# EAGLE design CANdiy-Shield_v12 (EAGLE 6.6.0)
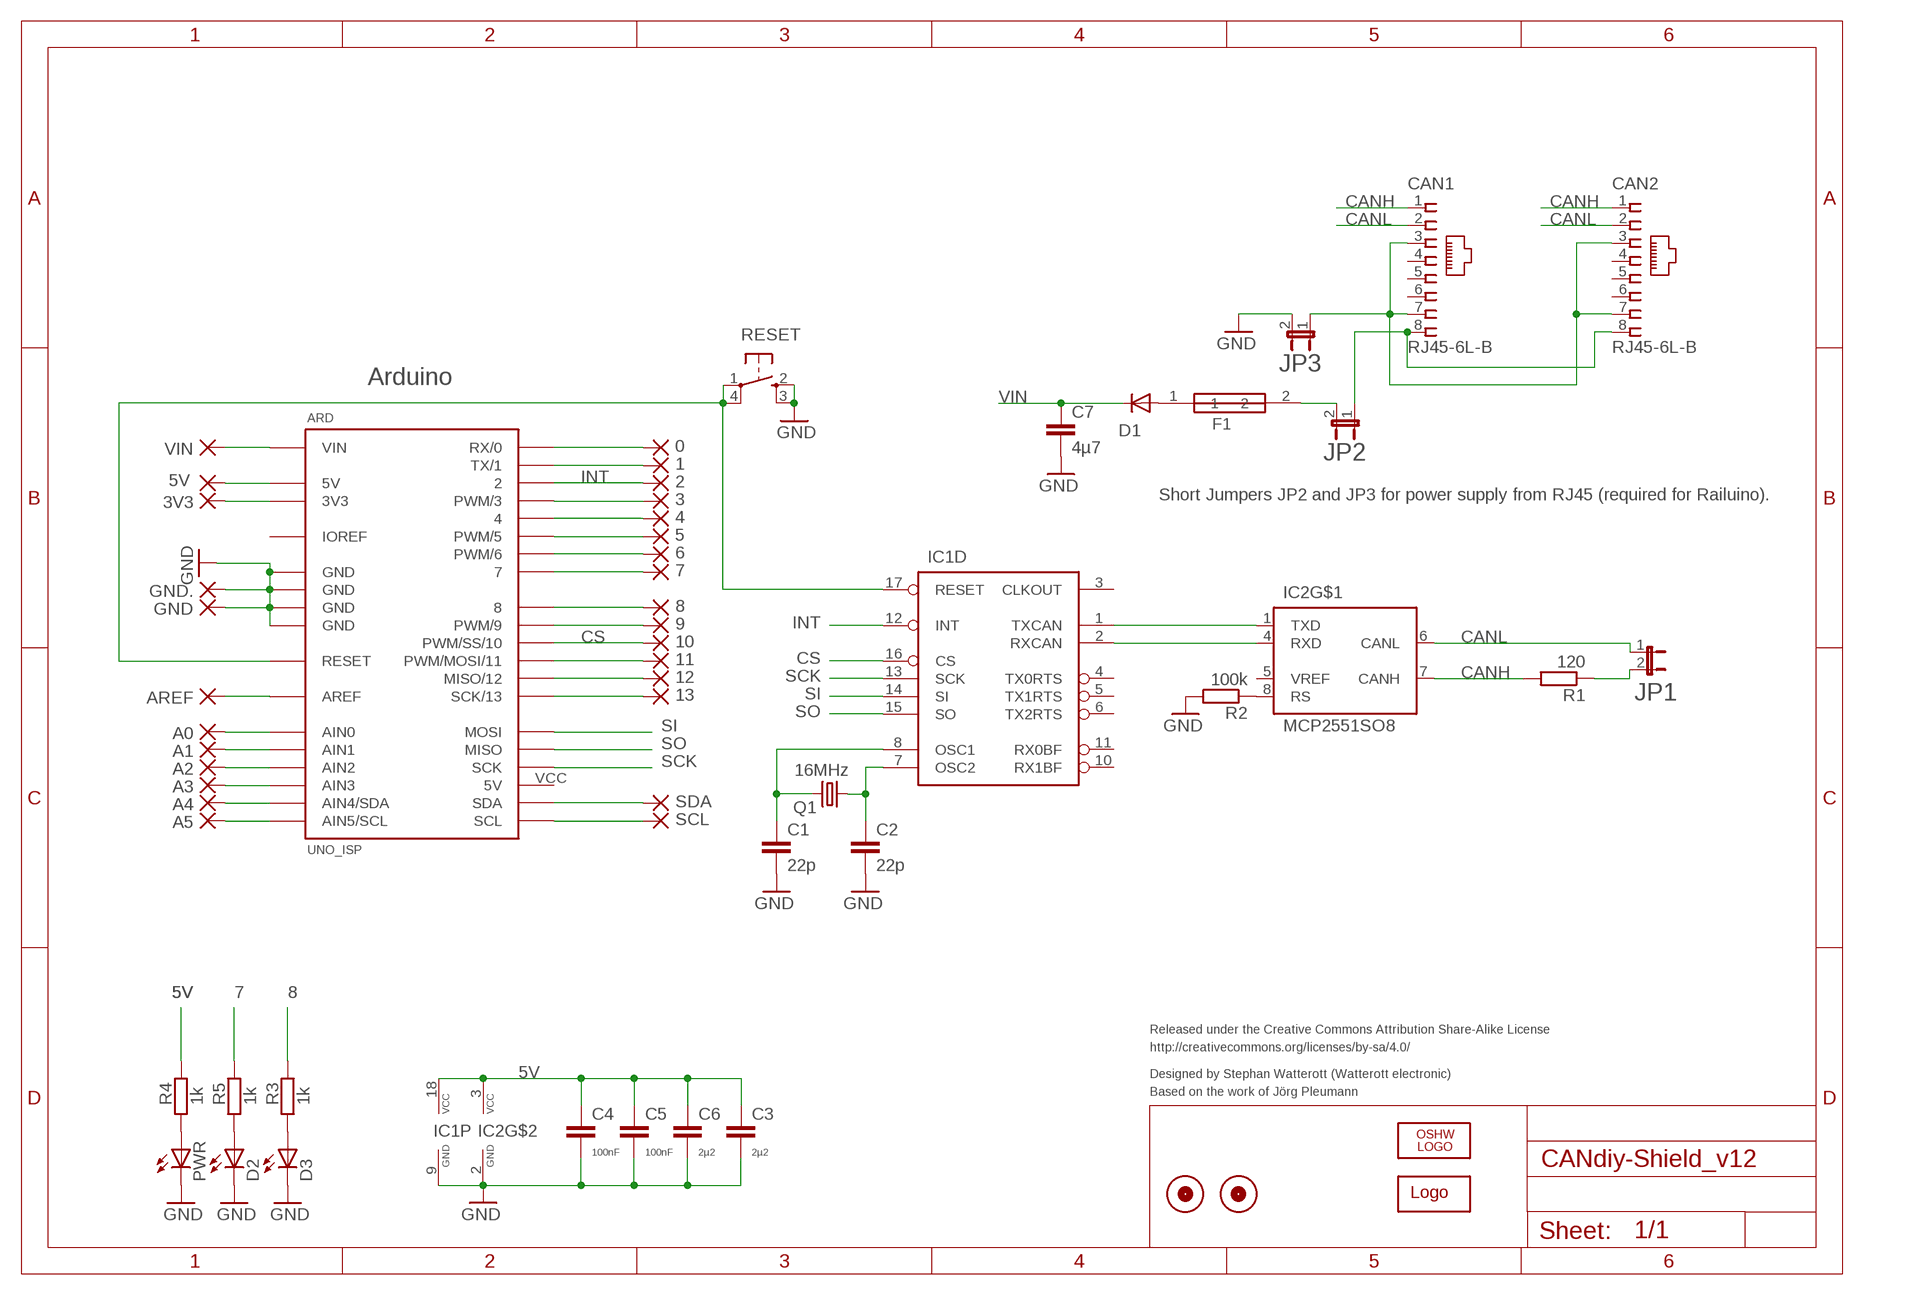
[diagram p0: schematic, sheet 1]

## Parts
0  1,6/0,8  [1,6/0,8]
1  1,6/0,8  [1,6/0,8]
2  1,6/0,8  [1,6/0,8]
3  1,6/0,8  [1,6/0,8]
3V3  1,6/0,8  [1,6/0,8]
4  1,6/0,8  [1,6/0,8]
5  1,6/0,8  [1,6/0,8]
5V  1,6/0,8  [1,6/0,8]
6  1,6/0,8  [1,6/0,8]
7  1,6/0,8  [1,6/0,8]
8  1,6/0,8  [1,6/0,8]
9  1,6/0,8  [1,6/0,8]
10  1,6/0,8  [1,6/0,8]
11  1,6/0,8  [1,6/0,8]
12  1,6/0,8  [1,6/0,8]
13  1,6/0,8  [1,6/0,8]
A0  1,6/0,8  [1,6/0,8]
A1  1,6/0,8  [1,6/0,8]
A2  1,6/0,8  [1,6/0,8]
A3  1,6/0,8  [1,6/0,8]
A4  1,6/0,8  [1,6/0,8]
A5  1,6/0,8  [1,6/0,8]
ARD  UNO_ISP  [UNO_ISP]
AREF  1,6/0,8  [1,6/0,8]
C1  22p  C-EUC0603  [C0603]
C2  22p  C-EUC0603  [C0603]
C3  2µ2  C-EUC0603  [C0603]
C4  100nF  C-EUC0603  [C0603]
C5  100nF  C-EUC0603  [C0603]
C6  2µ2  C-EUC0603  [C0603]
C7  4µ7  C-EUC1206  [C1206]
CAN1  RJ45-6L-B  [RJ45-NO-SHIELD]
CAN2  RJ45-6L-B  [RJ45-NO-SHIELD]
D1  CGRM4001-G  [SOD-123_MINI-SMA]
D2  LEDCHIPLED_0603  [CHIPLED_0603]
D3  LEDCHIPLED_0603  [CHIPLED_0603]
F1  F1  FUSE1812  [L1812]
GND  1,6/0,8  [1,6/0,8]
GND.  1,6/0,8  [1,6/0,8]
IC1  MCP2515SO  [SO-18W]
IC2  MCP2551SO8  [SO08]
JP1  JP1E  [JP1]
JP2  JP1E  [JP1]
JP3  JP1E  [JP1]
LOGO2  OSHW_LOGO_6MILX0100-NT  [OSHW_6X100_NOTEXT]
PWR  LEDCHIPLED_0603  [CHIPLED_0603]
Q1  16MHz  CRYSTALHC49UP  [HC49UP]
R1  120  R-EU_R0603  [R0603]
R2  100k  R-EU_R0603  [R0603]
R3  1k  R-EU_R0603  [R0603]
R4  1k  R-EU_R0603  [R0603]
R5  1k  R-EU_R0603  [R0603]
RESET  SW_SMDS  [SW_SMD4]
SCL  1,6/0,8  [1,6/0,8]
SDA  1,6/0,8  [1,6/0,8]
U$1  WE-LOGO  [WE-LOGO]
VIN  1,6/0,8  [1,6/0,8]
X_1  PASS_1MM  [ROUND_1MM]
X_2  PASS_1MM  [ROUND_1MM]

## Nets
3V3: 3V3.1(P) ARD.3V3
5V: 5V.1(P) ARD.5V C3.1 C4.1 C5.1 C6.1 IC1.18(P:VCC) IC2.3(VCC) R4.1
7: 7.1(P) ARD.7 R5.1
8: 8.1(P) ARD.8 R3.1
9: 9.1(P) ARD.9(PWM/9)
A0: A0.1(P) ARD.AIN0
AERF: ARD.AREF AREF.1(P)
CANH: CAN1.1 CAN2.1 IC2.7(CANH) R1.2
CANL: CAN1.2 CAN2.2 IC2.6(CANL) JP1.1
CS: 10.1(P) ARD.10(PWM/SS/10) IC1.16(D:CS)
GND: ARD.GND@1(GND) ARD.GND@2(GND) ARD.GND@3(GND) ARD.GND@4(GND) C1.2 C2.2 C3.2 C4.2 C5.2 C6.2 C7.2 D2.C D3.C GND.1(P) GND..1(P) IC1.9(P:GND) IC2.2(GND) JP3.2 PWR.C R2.2 RESET.2(S) RESET.3(S1)
INT: 2.1(P) ARD.2 IC1.12(D:INT)
N$4: C2.1 IC1.7(D:OSC2) Q1.1
N$5: C1.1 IC1.8(D:OSC1) Q1.2
N$6: CAN1.8 CAN2.8 JP2.1
N$7: IC2.8(RS) R2.1
N$8: CAN1.3 CAN1.7 CAN2.3 CAN2.7 JP3.1
N$9: JP1.2 R1.1
N$18: ARD.SCL SCL.1(P)
N$19: ARD.SDA SDA.1(P)
N$21: D3.A R3.2
N$22: PWR.A R4.2
N$23: D2.A R5.2
N$86: 11.1(P) ARD.11(PWM/MOSI/11)
N$87: 12.1(P) ARD.12(MISO/12)
N$88: 13.1(P) ARD.13(SCK/13)
N$98: 6.1(P) ARD.6(PWM/6)
N$99: 5.1(P) ARD.5(PWM/5)
N$100: 4.1(P) ARD.4
N$101: 3.1(P) ARD.3(PWM/3)
N$102: 1.1(P) ARD.1(TX/1)
N$103: 0.1(P) ARD.0(RX/0)
N$114: A1.1(P) ARD.AIN1
N$115: A2.1(P) ARD.AIN2
N$116: A3.1(P) ARD.AIN3
N$117: A4.1(P) ARD.AIN4(AIN4/SDA)
N$118: A5.1(P) ARD.AIN5(AIN5/SCL)
N$120: D1.A F1.1
N$121: F1.2 JP2.2
RESET: ARD.RST(RESET) IC1.17(D:RESET) RESET.1(P) RESET.4(P1)
RXCAN: IC1.2(D:RXCAN) IC2.4(RXD)
SCK: ARD.SCK IC1.13(D:SCK)
SI: ARD.MOSI IC1.14(D:SI)
SO: ARD.MISO IC1.15(D:SO)
TXCAN: IC1.1(D:TXCAN) IC2.1(TXD)
VIN: ARD.VIN C7.1 D1.C VIN.1(P)
Unconnected: ARD.VCC(5V) CAN1.4 CAN1.5 CAN1.6 CAN2.4 CAN2.5 CAN2.6 IC1.3(D:CLKOUT) IC1.4(D:TX0RTS) IC1.5(D:TX1RTS) IC1.6(D:TX2RTS) IC1.10(D:RX1BF) IC1.11(D:RX0BF) IC2.5(VREF)

## Notes on the sheet
- Arduino
- F1
- Short Jumpers JP2 and JP3 for power supply from RJ45 (required for Railuino).
- Released under the Creative Commons Attribution Share-Alike License
- http://creativecommons.org/licenses/by-sa/4.0/
- Designed by Stephan Watterott (Watterott electronic)
- Based on the work of Jörg Pleumann

## Power pins joined to a net without a drawn wire
IOREF: ARD.IOREF

## Library data of the parts
0 1-3 3V3 4 5 5V 6-13 A0 A1-A5 AREF GND GND. SCL SDA VIN = wirepad:1,6/0,8: THROUGH-HOLE PAD
ARD = Arduino:UNO_ISP
C1-C7 = resistor:C-EU: CAPACITOR, European symbol
CAN1 CAN2 = con-tycoelectronics:RJ45: CORCOM Modular RJ Jacks No Shield Source: www.tycoelectronics.com .. ENG_DS_1654001_1099_RJ_L_0507.pdf; MPN: RJ45-6L-B; OC_FARNELL: unknown; OC_NEWARK: 16R6090
D1 = diode:CGRM400*-G: Molded plasitc,JEDEC SOD-123/Mini SMA Source: Comchip CGRM4001-G.pdf
D2 D3 PWR = led:LED: LED OSRAM: - CHIPLED LG R971, LG N971, LY N971, LG Q971, LY Q971, LO R971, LY R971 LH N974, LH R974 LS Q976, LO Q976, LY Q976 LO Q996 - Hyper CHIPLED LW Q18S LB Q993, LB Q99A, LB R99A - SideLED LS A670, LO A670, LY A670, LG A670, LP A670 LB A673, LV A673, LT A673, LW A673 LH A674 LY A675 LS A676, LA A676, LO A676, LY A676, LW A676 LS A679, LY A679, LG A679 - Hyper Micro SIDELED® LS Y876, LA Y876, LO Y876, LY Y876 LT Y87S - SmartLED LW L88C, LW L88S LB L89C, LB L89S, LG L890 LS L89K, LO L89K, LY L89K LS L896, LA L896, LO L896, LY L896 - TOPLED LS T670, LO T670, LY T670, LG T670, LP T670 LSG T670, LSP T670, LSY T670, LOP T670, LYG T670 LG T671, LOG T671, LSG T671 LB T673, LV T673, LT T673, LW T673 LH T674 LS T676, LA T676, LO T676, LY T676, LB T676, LH T676, LSB T676, LW T676 LB T67C, LV T67C, LT T67C, LS T67K, LO T67K, LY T67K, LW E67C LS E67B, LA E67B, LO E67B, LY E67B, LB E67C, LV E67C, LT E67C LW T67C LS T679, LY T679, LG T679 LS T770, LO T770, LY T770, LG T770, LP T770 LB T773, LV T773, LT T773, LW T773 LH T774 LS E675, LA E675, LY E675, LS T675 LS T776, LA T776, LO T776, LY T776, LB T776 LHGB T686 LT T68C, LB T68C - Hyper Mini TOPLED® LB M676 - Mini TOPLED Santana® LG M470 LS M47K, LO M47K, LY M47K Source: http://www.osram.convergy.de LUXEON: - LUMILED® LXK2-PW12-R00, LXK2-PW12-S00, LXK2-PW14-U00, LXK2-PW14-V00 LXK2-PM12-R00, LXK2-PM12-S00, LXK2-PM14-U00 LXK2-PE12-Q00, LXK2-PE12-R00, LXK2-PE12-S00, LXK2-PE14-T00, LXK2-PE14-U00 LXK2-PB12-K00, LXK2-PB12-L00, LXK2-PB12-M00, LXK2-PB14-N00, LXK2-PB14-P00, LXK2-PB14-Q00 LXK2-PR12-L00, LXK2-PR12-M00, LXK2-PR14-Q00, LXK2-PR14-R00 LXK2-PD12-Q00, LXK2-PD12-R00, LXK2-PD12-S00 LXK2-PH12-R00, LXK2-PH12-S00 LXK2-PL12-P00, LXK2-PL12-Q00, LXK2-PL12-R00 Source: www.luxeon.com KINGBRIGHT: KA-3528ASYC Source: www.kingbright.com
F1 = resistor:FUSE1812
IC1 = can:MCP2515: MC2515 Stand-Alone CAN Controller With SPI Interface, Microchip
IC2 = can:MCP2551: CAN Tranceiver Microchip
JP1-JP3 = jumper:JP1E: JUMPER
LOGO2 = OSHW:OSHW_LOGO_6MIL
Q1 = crystal:CRYSTAL: CRYSTAL; OC_FARNELL: unknown; OC_NEWARK: unknown
R1 R2 = resistor:R-EU_: RESISTOR, European symbol
R3-R5 = rcl:R-EU_: RESISTOR, European symbol
RESET = Switch-SMD:SW_SMD
U$1 = welectronic:WE-LOGO
X_1 X_2 = marks:PASS_1MM

## Board
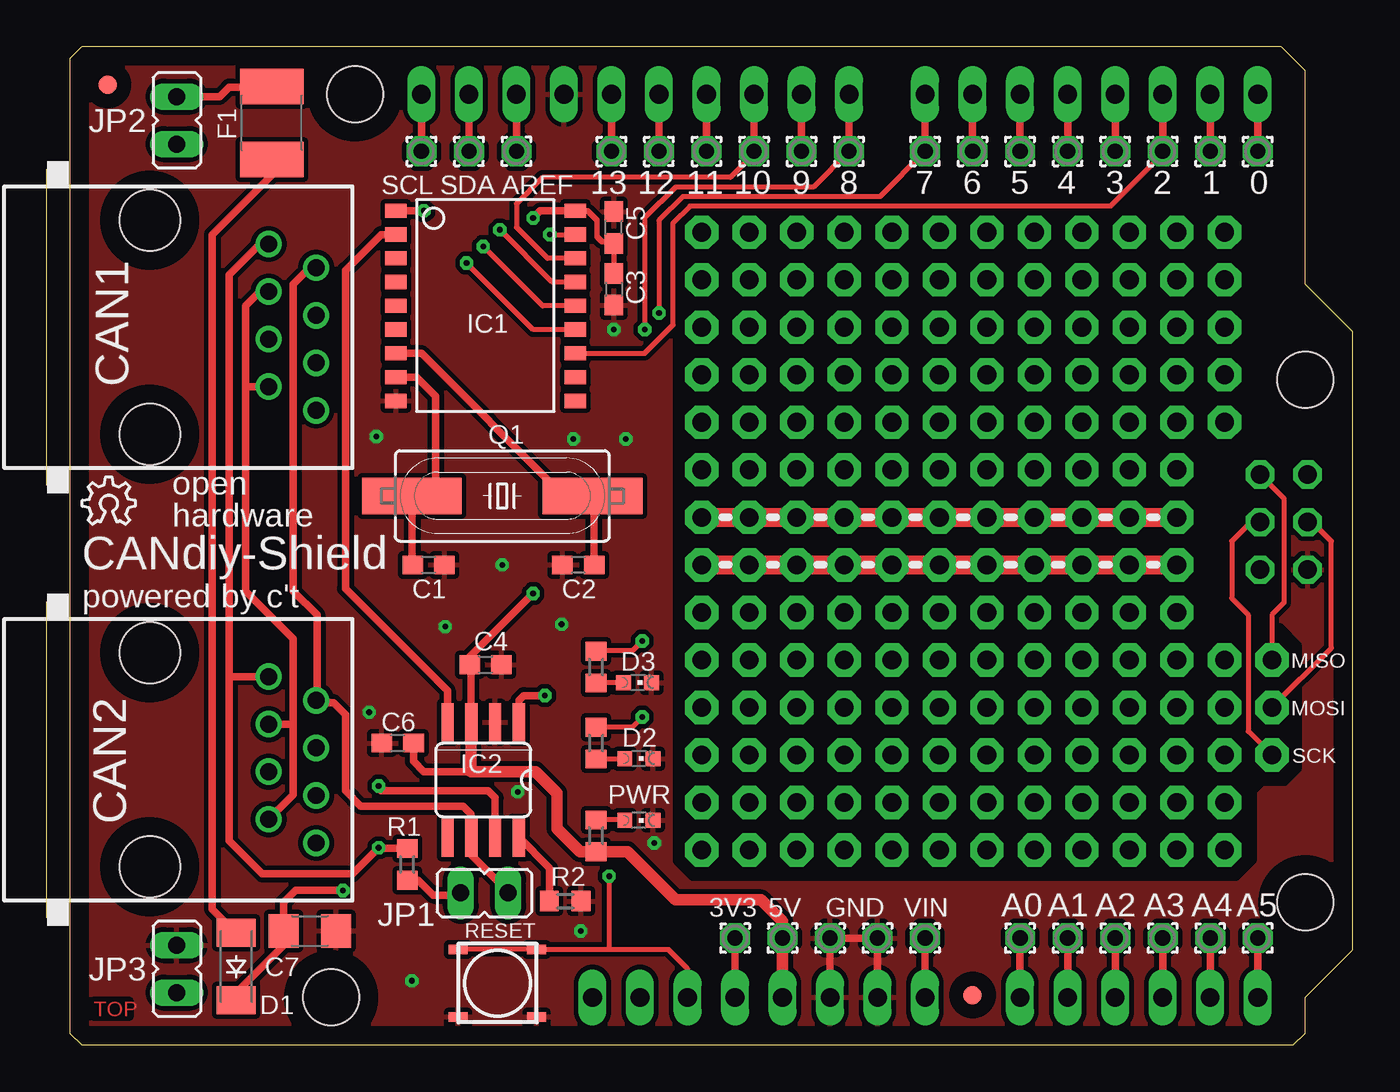
[diagram p1: board, top side]
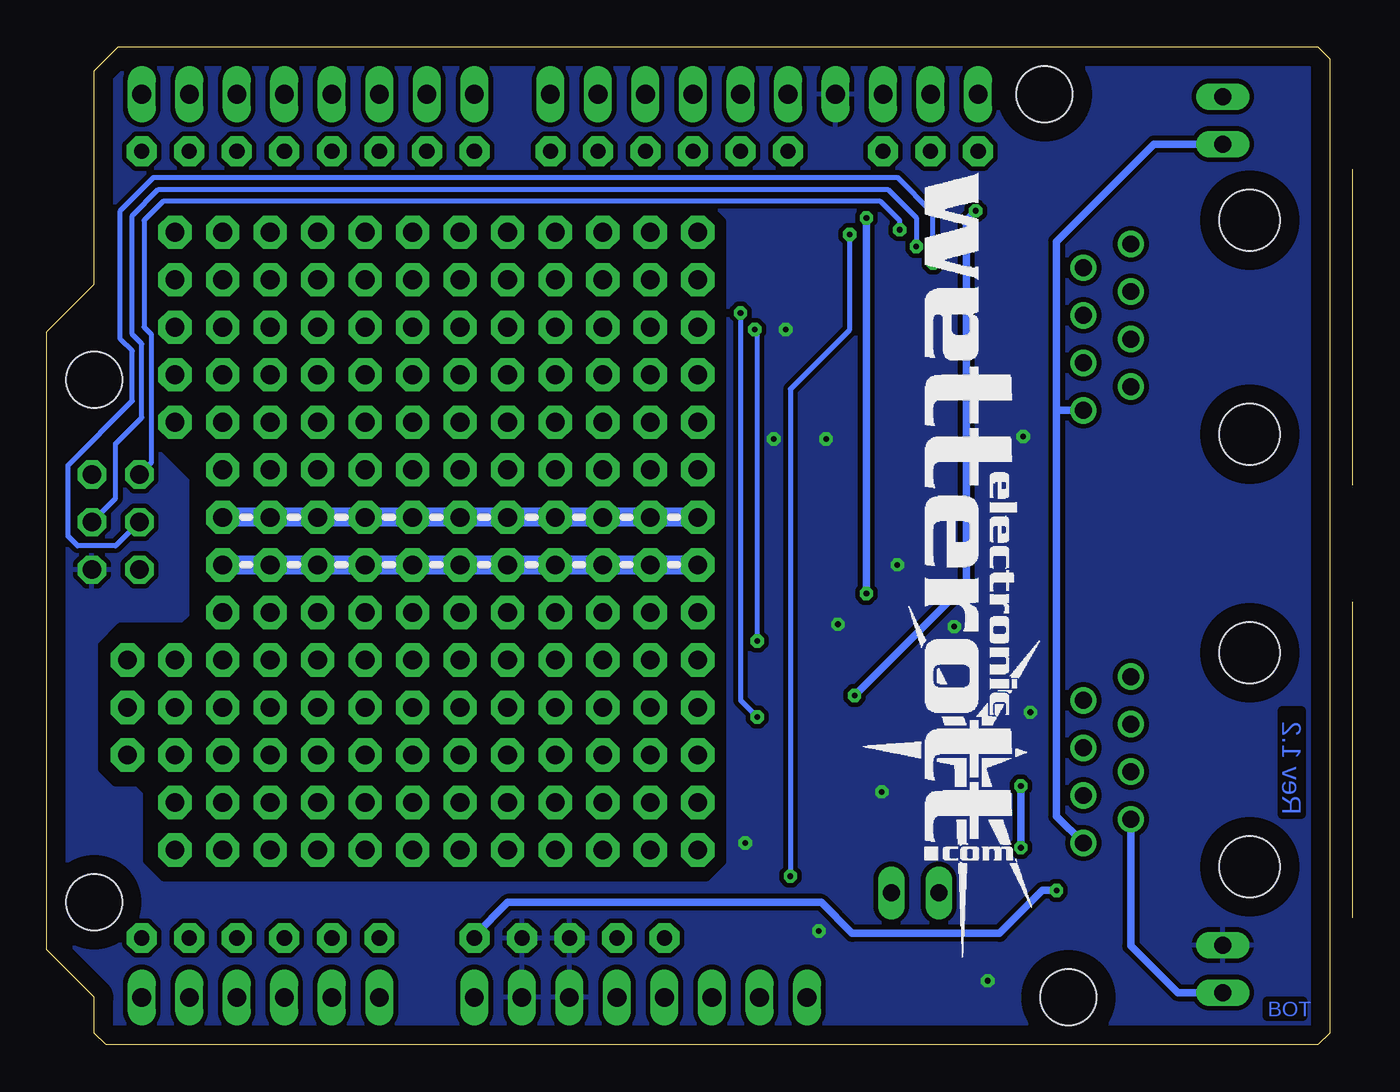
[diagram p2: board, bottom side, seen from below]

Size 69.81 x 53.34 mm. Coordinates in mm from the lower left corner, seen from the top.
Copper layers (1*16): Top 0.035mm / dielectric 1.5mm / Bottom 0.035mm
Design rules "default *": minimum track width 8mil, minimum drill 0.3mm, track to track 8mil, track to pad 8mil, pad to pad 8mil, via to via 8mil, smd to smd 8mil, copper to edge 40mil, drill to drill 8mil, minimum pad ring 10mil, minimum via ring 8mil, stop-mask expansion 4mil, vias tented up to drill 0.6mm, thermal gap 10mil

### Footprints (pad centres in the part's own frame; a part is rotated, then mirrored left to right if it is on the bottom)
1,6/0,8 = drill 0.813 pad 1.6 octagon: 1 0,0
UNO_ISP = drill 1 long: 0 63.5,50.8; 1 60.96,50.8; 2 58.42,50.8; 3 55.88,50.8; 3V3 35.56,2.54; 4 53.34,50.8; 5 50.8,50.8; 5V 38.1,2.54; 6 48.26,50.8; 7 45.72,50.8; 8 41.656,50.8; 9 39.116,50.8; 10 36.576,50.8; 11 34.036,50.8; 12 31.496,50.8; 13 28.956,50.8; AIN0 50.8,2.54; AIN1 53.34,2.54; AIN2 55.88,2.54; AIN3 58.42,2.54; AIN4 60.96,2.54; AIN5 63.5,2.54; AREF 23.876,50.8; GND@1 40.64,2.54; GND@2 43.18,2.54; GND@3 26.416,50.8; IOREF 30.48,2.54; NC 27.94,2.54; RST 33.02,2.54; SCL 18.796,50.8; SDA 21.336,50.8; VIN 45.72,2.54 | drill 1 octagon: GND@4 66.167,25.4; MISO 63.627,30.48; MOSI 66.167,27.94; RST2 63.627,25.4; SCK 63.627,27.94; VCC 66.167,30.48 | hole 3: 66.04,35.56; 66.04,7.62; 15.24,50.8; 13.97,2.54
C0603 = smd 1.1 x 1: 1 -0.85,0; 2 0.85,0
C1206 = smd 1.6 x 1.8: 1 -1.4,0; 2 1.4,0
RJ45-NO-SHIELD = drill 0.9 pad 1.4: 1 -4.445,6.35; 2 -3.175,8.89; 3 -1.905,6.35; 4 -0.635,8.89; 5 0.635,6.35; 6 1.905,8.89; 7 3.175,6.35; 8 4.445,8.89 | hole 3.251: -5.715,0; 5.715,0
SOD-123_MINI-SMA = smd 1.5 x 2.1: A 1.8,0; C -1.8,0
CHIPLED_0603 = smd 0.8 x 0.8: A 0,-0.75; C 0,0.75
L1812 = smd 1.9 x 3.4: 1 -1.95,0; 2 1.95,0
SO-18W = smd 0.762 x 1.143: 1 -5.08,-4.788; 2 -3.81,-4.788; 3 -2.54,-4.788; 4 -1.27,-4.788; 5 0,-4.788; 6 1.27,-4.788; 7 2.54,-4.788; 8 3.81,-4.788; 9 5.08,-4.788; 10 5.08,4.788; 11 3.81,4.788; 12 2.54,4.788; 13 1.27,4.788; 14 0,4.788; 15 -1.27,4.788; 16 -2.54,4.788; 17 -3.81,4.788; 18 -5.08,4.788
SO08 = smd 0.66 x 2.032: 1 -1.905,-3.073; 2 -0.635,-3.073; 3 0.635,-3.073; 4 1.905,-3.073; 5 1.905,3.073; 6 0.635,3.073; 7 -0.635,3.073; 8 -1.905,3.073
JP1 = drill 0.914 long: 1 0,-1.27; 2 0,1.27
HC49UP = smd 5.334 x 1.93: 1 -4.826,0; 2 4.826,0
R0603 = smd 1 x 1.1: 1 -0.85,0; 2 0.85,0
SW_SMD4 = smd 0.508 x 1.016: 1 -1.8,-2.1; 2 1.8,-2.1; 3 1.8,2.1; 4 -1.8,2.1
ROUND_1MM = smd 1 x 1: P$1 0,0

### Placement (x,y rotation side)
0  64.73,47.75 180 top
1  62.19,47.75 180 top
2  59.65,47.75 180 top
3  57.11,47.75 180 top
3V3  36.79,5.71 0 top
4  54.57,47.75 180 top
5  52.03,47.75 180 top
5V  39.33,5.71 0 top
6  49.49,47.75 180 top
7  46.95,47.75 180 top
8  42.89,47.75 180 top
9  40.35,47.75 180 top
10  37.81,47.75 180 top
11  35.27,47.75 180 top
12  32.73,47.75 180 top
13  30.19,47.75 180 top
A0  52.03,5.71 0 top
A1  54.57,5.71 0 top
A2  57.11,5.71 0 top
A3  59.65,5.71 0 top
A4  62.19,5.71 0 top
A5  64.73,5.71 0 top
ARD  1.23,0 0 top
AREF  25.11,47.75 0 top
C1  20.41,25.65 0 top
C2  28.41,25.65 180 top
C3  30.31,40.39 270 top
C4  23.46,20.32 0 top
C5  30.31,43.69 90 top
C6  18.76,16.13 180 top
C7  14.06,6.1 0 top
CAN1  5.51,38.35 270 top
CAN2  5.51,15.24 270 top
D1  10.12,4.19 90 top
D2  31.65,15.3 270 top
D3  31.58,19.37 270 top
F1  12.03,49.28 90 top
GND  41.87,5.71 0 top
GND.  44.41,5.71 0 top
IC1  23.46,39.5 270 top
IC2  23.33,14.16 180 top
JP1  23.39,8.13 90 top
JP2  6.95,49.4 0 top
JP3  6.95,4.06 0 top
LOGO2  1.9,27.81 0 top
PWR  31.65,12 270 top
Q1  24.35,29.34 180 top
R1  19.27,9.65 90 top
R2  27.71,7.68 0 top
R3  29.36,20.19 270 top
R4  29.36,11.18 90 top
R5  29.36,16.13 270 top
RESET  24.09,3.3 270 top
SCL  20.03,47.75 180 top
SDA  22.57,47.75 180 top
U$1  26.5,46.86 270 bottom
VIN  46.95,5.71 0 top
X_1  3.26,51.31 0 top
X_2  49.49,2.67 0 top

### Tracks (layer width: path | path; a pad name or v marks a point on that pad's centre or on a via)
3V3
  Top 0.406: ARD.3V3 3V3.1
5V  (via drill 0.3)
  Top 0.305: C3.1 C5.1 30.23,42.93 29.68,42.93 29.43,43.18 29.43,44.07 28.92,44.58 IC1.18
  Top 0.406: C6.1 19.61,15.15 20.15,14.61 22.69,14.61 | v26,44.2 26.38,44.58 IC1.18 | IC2.3 22.69,20.23 C4.1 22.61,20.74 v26,24.13
  Top 0.61: ARD.5V 5V.1 39.33,6.6 38.19,7.75 33.62,7.75 31.04,10.33 R4.1 28.5,10.33 27.27,11.56 27.27,13.46 26.12,14.61 22.69,14.61 IC2.3
  Bottom 0.406: v26,24.13 v26,44.2
7  (via drill 0.3)
  Top 0.254: 7.1 44.54,45.34 34,45.34 32.73,44.07 v32.73,39.12 | R5.1 29.4,17.02 31.33,17.02 v31.84,17.53
  Top 0.406: ARD.7 7.1
  Bottom 0.254: v32.73,39.12 32.73,18.41 v31.84,17.53
8  (via drill 0.3)
  Top 0.254: 8.1 40.98,45.85 33.62,45.85 31.97,44.2 v31.97,38.23 | R3.1 29.4,21.08 31.33,21.08 v31.84,21.59
  Top 0.406: ARD.8 8.1
  Bottom 0.254: v31.97,38.23 31.84,38.1 v31.84,21.59
9
  Top 0.406: ARD.9 9.1
A0
  Top 0.406: ARD.AIN0 A0.1
AERF
  Top 0.406: AREF.1 ARD.AREF
CANH  (via drill 0.3)
  Top 0.406: 9.74,19.68 9.74,41.15 11.39,42.8 CAN1.1 | 9.74,19.68 9.74,10.92 11.52,9.14 16.34,9.14 v17.74,10.54 17.78,10.5 R1.2 | CAN2.1 9.74,19.68 | IC2.7 23.96,13.21 23.58,13.59 17.87,13.59 17.74,13.72 v17.74,13.84
  Bottom 0.406: v17.74,13.84 v17.74,10.54
CANL
  Top 0.406: JP1.1 24.66,8.19 22.69,10.16 IC2.6 22.69,12.32 22.25,12.76 16.79,12.76 15.96,13.59 15.96,17.65 15.33,18.29 14.53,18.29 CAN2.2 14.44,18.45 14.44,22.99 13.17,24.26 13.17,40.64 14.06,41.53 CAN1.2
CS
  Top 0.254: 10.1 37.81,47.62 36.54,46.36 26.5,46.36 25.11,44.96 25.11,43.69 26.76,42.04 IC1.16
  Top 0.406: ARD.10 10.1
GND  (via drill 0.3)
  Top 0.406: ARD.GND@1 GND.1 GND..1 ARD.GND@2
  other vias: 28.16,32.39 21.3,22.35 17.61,32.51 25.17,13.53 32.47,10.79 30.31,38.23 27.52,22.48 24.35,25.65 19.52,3.43 28.54,6.1 17.23,17.78 30.95,32.39
  pour Bottom (isolate 0.254): 1.23,53.47 69.81,53.47 69.81,0.13 1.23,0.13
  pour Top (isolate 0.254): 1.23,0.13 1.23,53.47 69.81,53.47 69.81,0.13
INT
  Top 0.254: 2.1 59.65,47.62 56.86,44.83 34.38,44.83 33.49,43.94 33.49,38.48 31.97,36.96 IC1.12
  Top 0.406: ARD.2 2.1
N$4
  Top 0.406: IC1.7 20.03,36.96 27.39,29.59 28.92,29.59 Q1.1 29.26,29.25 C2.1
N$5
  Top 0.406: IC1.8 19.77,35.69 20.79,34.67 20.79,30.23 20.54,29.97 20.15,29.97 Q1.2 19.52,25.69 C1.1
N$6
  Bottom 0.406: 15.84,33.91 15.84,42.93 10.63,48.13 JP2.1 | 15.84,33.91 15.84,12.23 CAN2.8 | CAN1.8 15.84,33.91
N$7
  Top 0.406: R2.1 26.89,7.71 26.89,9.44 IC2.8
N$8
  Top 0.406: 10.63,35.05 10.63,39.5 11.39,40.26 CAN1.3 | 10.63,35.05 10.63,24.26 13.17,21.72 13.17,17.27 | 13.17,17.27 13.17,13.37 CAN2.7 | CAN2.3 13.04,17.14 13.17,17.27 | CAN1.7 10.76,35.18 10.63,35.05
  Bottom 0.406: CAN2.7 11.86,5.3 9.36,2.79 JP3.1
N$9
  Top 0.406: R1.1 19.86,8.8 20.66,8 22,8 JP1.2
N$10  (via drill 1 pad 1.78)
  other vias: 60.41,35.81
N$11  (via drill 1 pad 1.78)
  other vias: 57.87,35.81
N$12  (via drill 1 pad 1.78)
  other vias: 55.33,35.81
N$14  (via drill 1 pad 1.78)
  other vias: 52.79,35.81
N$15  (via drill 1 pad 1.78)
  other vias: 50.25,35.81
N$16  (via drill 1 pad 1.78)
  other vias: 47.71,35.81
N$17  (via drill 1 pad 1.78)
  other vias: 45.17,35.81
N$18
  Top 0.406: SCL.1 ARD.SCL
N$19
  Top 0.406: SDA.1 ARD.SDA
N$20  (via drill 1 pad 1.78)
  other vias: 42.63,38.35
N$21
  Top 0.254: D3.A 30.81,19.34 R3.2
N$22
  Top 0.254: PWR.A 30.87,12.03 R4.2
N$23
  Top 0.254: D2.A 30.87,15.28 R5.2
N$24  (via drill 1 pad 1.78)
  other vias: 42.63,10.41
N$25  (via drill 1 pad 1.78)
  other vias: 42.63,35.81
N$26  (via drill 1 pad 1.78)
  other vias: 62.95,38.35
N$27  (via drill 1 pad 1.78)
  other vias: 60.41,38.35
N$28  (via drill 1 pad 1.78)
  other vias: 57.87,38.35
N$29  (via drill 1 pad 1.78)
  other vias: 55.33,38.35
N$30  (via drill 1 pad 1.78)
  other vias: 52.79,38.35
N$31  (via drill 1 pad 1.78)
  other vias: 50.25,38.35
N$32  (via drill 1 pad 1.78)
  other vias: 47.71,38.35
N$33  (via drill 1 pad 1.78)
  other vias: 45.17,38.35
N$34  (via drill 1 pad 1.78)
  other vias: 42.63,33.27
N$35  (via drill 1 pad 1.78)
  other vias: 42.63,30.73
N$36  (via drill 1 pad 1.78)
  other vias: 42.63,28.19
N$37  (via drill 1 pad 1.78)
  other vias: 62.95,40.89
N$38  (via drill 1 pad 1.78)
  other vias: 60.41,40.89
N$39  (via drill 1 pad 1.78)
  other vias: 57.87,40.89
N$40  (via drill 1 pad 1.78)
  other vias: 55.33,40.89
N$41  (via drill 1 pad 1.78)
  other vias: 62.95,20.57
N$42  (via drill 1 pad 1.78)
  other vias: 62.95,10.41
N$43  (via drill 1 pad 1.78)
  other vias: 60.41,10.41
N$44  (via drill 1 pad 1.78)
  other vias: 57.87,10.41
N$45  (via drill 1 pad 1.78)
  other vias: 55.33,10.41
N$46  (via drill 1 pad 1.78)
  other vias: 52.79,10.41
N$47  (via drill 1 pad 1.78)
  other vias: 50.25,10.41
N$48  (via drill 1 pad 1.78)
  other vias: 47.71,10.41
N$49  (via drill 1 pad 1.78)
  other vias: 45.17,10.41
N$50  (via drill 1 pad 1.78)
  other vias: 52.79,40.89
N$51  (via drill 1 pad 1.78)
  other vias: 50.25,40.89
N$52  (via drill 1 pad 1.78)
  other vias: 47.71,40.89
N$53  (via drill 1 pad 1.78)
  other vias: 45.17,40.89
N$54  (via drill 1 pad 1.78)
  other vias: 42.63,25.65
N$55  (via drill 1 pad 1.78)
  other vias: 62.95,43.43
N$56  (via drill 1 pad 1.78)
  other vias: 60.41,43.43
N$57  (via drill 1 pad 1.78)
  other vias: 57.87,43.43
N$58  (via drill 1 pad 1.78)
  other vias: 55.33,43.43
N$59  (via drill 1 pad 1.78)
  other vias: 60.41,33.27
N$60  (via drill 1 pad 1.78)
  other vias: 57.87,33.27
N$61  (via drill 1 pad 1.78)
  other vias: 55.33,33.27
N$62  (via drill 1 pad 1.78)
  other vias: 52.79,33.27
N$63  (via drill 1 pad 1.78)
  other vias: 50.25,33.27
N$64  (via drill 1 pad 1.78)
  other vias: 47.71,33.27
N$65  (via drill 1 pad 1.78)
  other vias: 45.17,33.27
N$66  (via drill 1 pad 1.78)
  other vias: 52.79,43.43
N$67  (via drill 1 pad 1.78)
  other vias: 50.25,43.43
N$68  (via drill 1 pad 1.78)
  other vias: 47.71,43.43
N$69  (via drill 1 pad 1.78)
  other vias: 45.17,43.43
N$70  (via drill 1 pad 1.78)
  other vias: 42.63,23.11
N$71  (via drill 1 pad 1.78)
  other vias: 40.09,10.41
N$72  (via drill 1 pad 1.78)
  other vias: 62.95,18.03
N$73  (via drill 1 pad 1.78)
  other vias: 62.95,15.49
N$74  (via drill 1 pad 1.78)
  other vias: 62.95,12.95
N$75  (via drill 1 pad 1.78)
  other vias: 60.41,30.73
N$76  (via drill 1 pad 1.78)
  other vias: 57.87,30.73
N$77  (via drill 1 pad 1.78)
  other vias: 55.33,30.73
N$78  (via drill 1 pad 1.78)
  other vias: 52.79,30.73
N$79  (via drill 1 pad 1.78)
  other vias: 50.25,30.73
N$80  (via drill 1 pad 1.78)
  other vias: 47.71,30.73
N$81  (via drill 1 pad 1.78)
  other vias: 45.17,30.73
N$82  (via drill 1 pad 1.78)
  other vias: 42.63,20.57
N$83  (via drill 1 pad 1.78)
  other vias: 42.63,18.03
N$84  (via drill 1 pad 1.78)
  other vias: 42.63,15.49
N$85  (via drill 1 pad 1.78)
  other vias: 42.63,12.95
N$86
  Top 0.406: 11.1 ARD.11
N$87
  Top 0.406: 12.1 ARD.12
N$88
  Top 0.406: 13.1 ARD.13
N$89  (via drill 1 pad 1.78)
  other vias: 37.55,10.41
N$90  (via drill 1 pad 1.78)
  other vias: 42.63,40.89
N$91
  cutout Top: 33.62,43.88 34.44,44.83 63.84,44.83 64.41,44.26 64.41,32.64 62.06,30.29 62.06,22.86 62.51,22.42 65.94,22.42 66.95,21.4 66.95,14.73 66.19,13.97 64.99,13.97 64.54,13.53 64.54,9.84 63.59,8.89 34.51,8.89 33.62,9.78 33.62,44.07
N$92  (via drill 1 pad 1.78)
  other vias: 57.87,28.19
N$93  (via drill 1 pad 1.78)
  other vias: 55.33,28.19
N$94  (via drill 1 pad 1.78)
  other vias: 52.79,28.19
N$95  (via drill 1 pad 1.78)
  other vias: 50.25,28.19
N$96  (via drill 1 pad 1.78)
  other vias: 47.71,28.19
N$97  (via drill 1 pad 1.78)
  other vias: 45.17,28.19
N$98
  Top 0.406: ARD.6 6.1
N$99
  Top 0.406: ARD.5 5.1
N$100
  Top 0.406: ARD.4 4.1
N$101
  Top 0.406: ARD.3 3.1
N$102
  Top 0.406: ARD.1 1.1
N$103
  Top 0.406: ARD.0 0.1
N$104  (via drill 1 pad 1.78)
  other vias: 42.63,43.43
N$107  (via drill 1 pad 1.78)
  Top 1.016: 35.14,25.65 v60.41,25.65
  Bottom 1.016: v60.41,25.65 35.14,25.65
N$108  (via drill 1 pad 1.78)
  other vias: 57.87,25.65
N$109  (via drill 1 pad 1.78)
  other vias: 55.33,25.65
N$110  (via drill 1 pad 1.78)
  other vias: 52.79,25.65
N$111  (via drill 1 pad 1.78)
  other vias: 50.25,25.65
N$112  (via drill 1 pad 1.78)
  other vias: 47.71,25.65
N$113  (via drill 1 pad 1.78)
  other vias: 45.17,25.65
N$114
  Top 0.406: ARD.AIN1 A1.1
N$115
  Top 0.406: ARD.AIN2 A2.1
N$116
  Top 0.406: ARD.AIN3 A3.1
N$117
  Top 0.406: ARD.AIN4 A4.1
N$118
  Top 0.406: ARD.AIN5 A5.1
N$119  (via drill 1 pad 1.78)
  other vias: 62.95,35.81
N$120
  Top 0.406: F1.1 12.03,46.48 8.85,43.31 8.85,7.26 D1.A
N$121
  Top 0.406: F1.2 11.98,51.18 9.74,51.18 9.23,50.67 JP2.2
N$122
  cutout Bottom: 33.62,44.01 34.44,44.83 63.84,44.83 64.41,44.26 64.41,32.64 62.06,30.29 62.06,22.86 62.51,22.42 65.94,22.42 66.95,21.4 66.95,14.73 66.19,13.97 64.99,13.97 64.54,13.53 64.54,9.84 63.59,8.89 34.51,8.89 33.62,9.78
N$123  (via drill 1 pad 1.78)
  other vias: 60.41,23.11
N$124  (via drill 1 pad 1.78)
  other vias: 57.87,23.11
N$125  (via drill 1 pad 1.78)
  other vias: 55.33,23.11
N$126  (via drill 1 pad 1.78)
  other vias: 52.79,23.11
N$127  (via drill 1 pad 1.78)
  other vias: 50.25,23.11
N$128  (via drill 1 pad 1.78)
  other vias: 47.71,23.11
N$129  (via drill 1 pad 1.78)
  other vias: 45.17,23.11
N$130  (via drill 1 pad 1.78)
  other vias: 40.09,38.35
N$131  (via drill 1 pad 1.78)
  other vias: 37.55,38.35
N$132  (via drill 1 pad 1.78)
  other vias: 40.09,35.81
N$133  (via drill 1 pad 1.78)
  other vias: 37.55,35.81
N$134  (via drill 1 pad 1.78)
  other vias: 40.09,33.27
N$135  (via drill 1 pad 1.78)
  other vias: 37.55,33.27
N$136  (via drill 1 pad 1.78)
  other vias: 40.09,30.73
N$137  (via drill 1 pad 1.78)
  other vias: 37.55,30.73
N$138  (via drill 1 pad 1.78)
  other vias: 40.09,28.19
N$139  (via drill 1 pad 1.78)
  other vias: 60.41,20.57
N$140  (via drill 1 pad 1.78)
  other vias: 57.87,20.57
N$141  (via drill 1 pad 1.78)
  other vias: 55.33,20.57
N$142  (via drill 1 pad 1.78)
  other vias: 52.79,20.57
N$143  (via drill 1 pad 1.78)
  other vias: 50.25,20.57
N$144  (via drill 1 pad 1.78)
  other vias: 47.71,20.57
N$145  (via drill 1 pad 1.78)
  other vias: 45.17,20.57
N$146  (via drill 1 pad 1.78)
  other vias: 37.55,28.19
N$147  (via drill 1 pad 1.78)
  other vias: 40.09,40.89
N$148  (via drill 1 pad 1.78)
  other vias: 37.55,40.89
N$149  (via drill 1 pad 1.78)
  other vias: 40.09,43.43
N$150  (via drill 1 pad 1.78)
  other vias: 37.55,43.43
N$151  (via drill 1 pad 1.78)
  other vias: 35.01,38.35
N$152  (via drill 1 pad 1.78)
  other vias: 35.01,35.81
N$153  (via drill 1 pad 1.78)
  other vias: 35.01,33.27
N$154  (via drill 1 pad 1.78)
  other vias: 35.01,30.73
N$155  (via drill 1 pad 1.78)
  other vias: 60.41,18.03
N$156  (via drill 1 pad 1.78)
  other vias: 57.87,18.03
N$157  (via drill 1 pad 1.78)
  other vias: 55.33,18.03
N$158  (via drill 1 pad 1.78)
  other vias: 52.79,18.03
N$159  (via drill 1 pad 1.78)
  other vias: 50.25,18.03
N$160  (via drill 1 pad 1.78)
  other vias: 47.71,18.03
N$161  (via drill 1 pad 1.78)
  other vias: 45.17,18.03
N$162  (via drill 1 pad 1.78)
  Top 1.016: v35.01,28.19 v60.41,28.19
  Bottom 1.016: v35.01,28.19 v60.41,28.19
N$163  (via drill 1 pad 1.78)
  other vias: 35.01,40.89
N$164  (via drill 1 pad 1.78)
  other vias: 35.01,43.43
N$165  (via drill 1 pad 1.78)
  other vias: 40.09,25.65
N$166  (via drill 1 pad 1.78)
  other vias: 37.55,25.65
N$167  (via drill 1 pad 1.78)
  other vias: 40.09,23.11
N$168  (via drill 1 pad 1.78)
  other vias: 37.55,23.11
N$169  (via drill 1 pad 1.78)
  other vias: 40.09,20.57
N$171  (via drill 1 pad 1.78)
  other vias: 60.41,15.49
N$172  (via drill 1 pad 1.78)
  other vias: 57.87,15.49
N$173  (via drill 1 pad 1.78)
  other vias: 55.33,15.49
N$174  (via drill 1 pad 1.78)
  other vias: 52.79,15.49
N$175  (via drill 1 pad 1.78)
  other vias: 50.25,15.49
N$176  (via drill 1 pad 1.78)
  other vias: 47.71,15.49
N$177  (via drill 1 pad 1.78)
  other vias: 45.17,15.49
N$178  (via drill 1 pad 1.78)
  other vias: 37.55,20.57
N$179  (via drill 1 pad 1.78)
  other vias: 40.09,18.03
N$180  (via drill 1 pad 1.78)
  other vias: 37.55,18.03
N$181  (via drill 1 pad 1.78)
  other vias: 40.09,15.49
N$182  (via drill 1 pad 1.78)
  other vias: 37.55,15.49
N$183  (via drill 1 pad 1.78)
  other vias: 40.09,12.95
N$184  (via drill 1 pad 1.78)
  other vias: 37.55,12.95
N$185  (via drill 1 pad 1.78)
  other vias: 35.01,10.41
N$186  (via drill 1 pad 1.78)
  other vias: 35.01,25.65
N$187  (via drill 1 pad 1.78)
  other vias: 60.41,12.95
N$188  (via drill 1 pad 1.78)
  other vias: 57.87,12.95
N$189  (via drill 1 pad 1.78)
  other vias: 55.33,12.95
N$190  (via drill 1 pad 1.78)
  other vias: 52.79,12.95
N$191  (via drill 1 pad 1.78)
  other vias: 50.25,12.95
N$192  (via drill 1 pad 1.78)
  other vias: 47.71,12.95
N$193  (via drill 1 pad 1.78)
  other vias: 45.17,12.95
N$194  (via drill 1 pad 1.78)
  other vias: 35.01,23.11
N$195  (via drill 1 pad 1.78)
  other vias: 35.01,20.57
N$196  (via drill 1 pad 1.78)
  other vias: 35.01,18.03
N$197  (via drill 1 pad 1.78)
  other vias: 35.01,15.49
N$198  (via drill 1 pad 1.78)
  other vias: 35.01,12.95
N$2512  (via drill 1 pad 1.78)
  other vias: 62.95,33.27
RESET  (via drill 0.3)
  Top 0.254: 30.06,5.1 RESET.4 RESET.1 | 30.06,5.1 33.21,5.1 34.25,4.06 ARD.RST | v30.06,9.02 30.06,5.1 | v26.89,43.31 IC1.17
  Bottom 0.254: v30.06,9.02 30.06,35.05 26.89,38.23 v26.89,43.31
RXCAN
  Top 0.406: IC2.4 21.42,18.92 15.96,24.38 15.96,41.4 17.87,43.31 IC1.2
SCK  (via drill 0.3, 1 pad 1.78)
  Top 0.254: ARD.SCK 64.35,27.94 63.33,26.92 63.33,23.88 64.22,22.99 64.22,16.76 v65.49,15.49 | IC1.13 26,38.23 v22.44,41.78
  Bottom 0.254: ARD.SCK 66.13,26.67 68.16,26.67 68.67,27.18 68.67,30.99 65.24,34.42 65.24,37.08 65.87,37.72 65.87,44.58 64.1,46.36 24.35,46.36 22.44,44.45 v22.44,41.78
SI  (via drill 0.3, 1 pad 1.78)
  Top 0.254: v65.49,18.03 68.67,21.21 68.67,26.92 67.65,27.94 ARD.MOSI | IC1.14 26.5,39.5 v23.33,42.67
  Bottom 0.254: ARD.MOSI 66.13,29.21 66.13,32.13 64.73,33.53 64.73,37.47 65.24,37.97 65.24,44.32 63.84,45.72 24.85,45.72 23.33,44.2 v23.33,42.67
SO  (via drill 0.3, 1 pad 1.78)
  Top 0.254: ARD.MISO 66.13,29.21 66.13,23.62 65.49,22.99 v65.49,20.57 | IC1.15 27.01,40.77 v24.22,43.56
  Bottom 0.254: ARD.MISO 64.22,31.11 64.22,37.97 64.6,38.35 64.6,44.07 63.59,45.09 25.23,45.09 24.22,44.07 v24.22,43.56
TXCAN  (via drill 0.3)
  Top 0.406: v20.15,44.58 IC1.1 | IC2.1 25.23,18.41 25.49,18.67 v26.63,18.67
  Bottom 0.406: v26.63,18.67 20.66,24.64 20.66,44.07 v20.15,44.58
VIN  (via drill 0.3)
  Top 0.254: C7.1 12.66,5.33 12.47,5.14
  Top 0.406: v15.84,8.26 13.3,8.26 12.66,7.62 12.66,5.33 12.47,5.14 10.25,2.92 10.25,2.52 D1.C | ARD.VIN VIN.1
  Bottom 0.406: VIN.1 46.95,5.84 45.17,7.62 28.41,7.62 26.76,5.97 18.88,5.97 16.6,8.26 v15.84,8.26

### Text on the board
Top: TOP
Bottom: Rev 1.2 | BOT
tPlace: open | hardware | CANdiy-Shield | powered by c't | MISO | MOSI | SCK | 5V | GND
Reference: Silkscreen: 21 tPlace + 22 bPlace